# Altium schematic sheet LMR514205V.SchDoc
size A; SheetNumber: 7; SheetTotal: 8
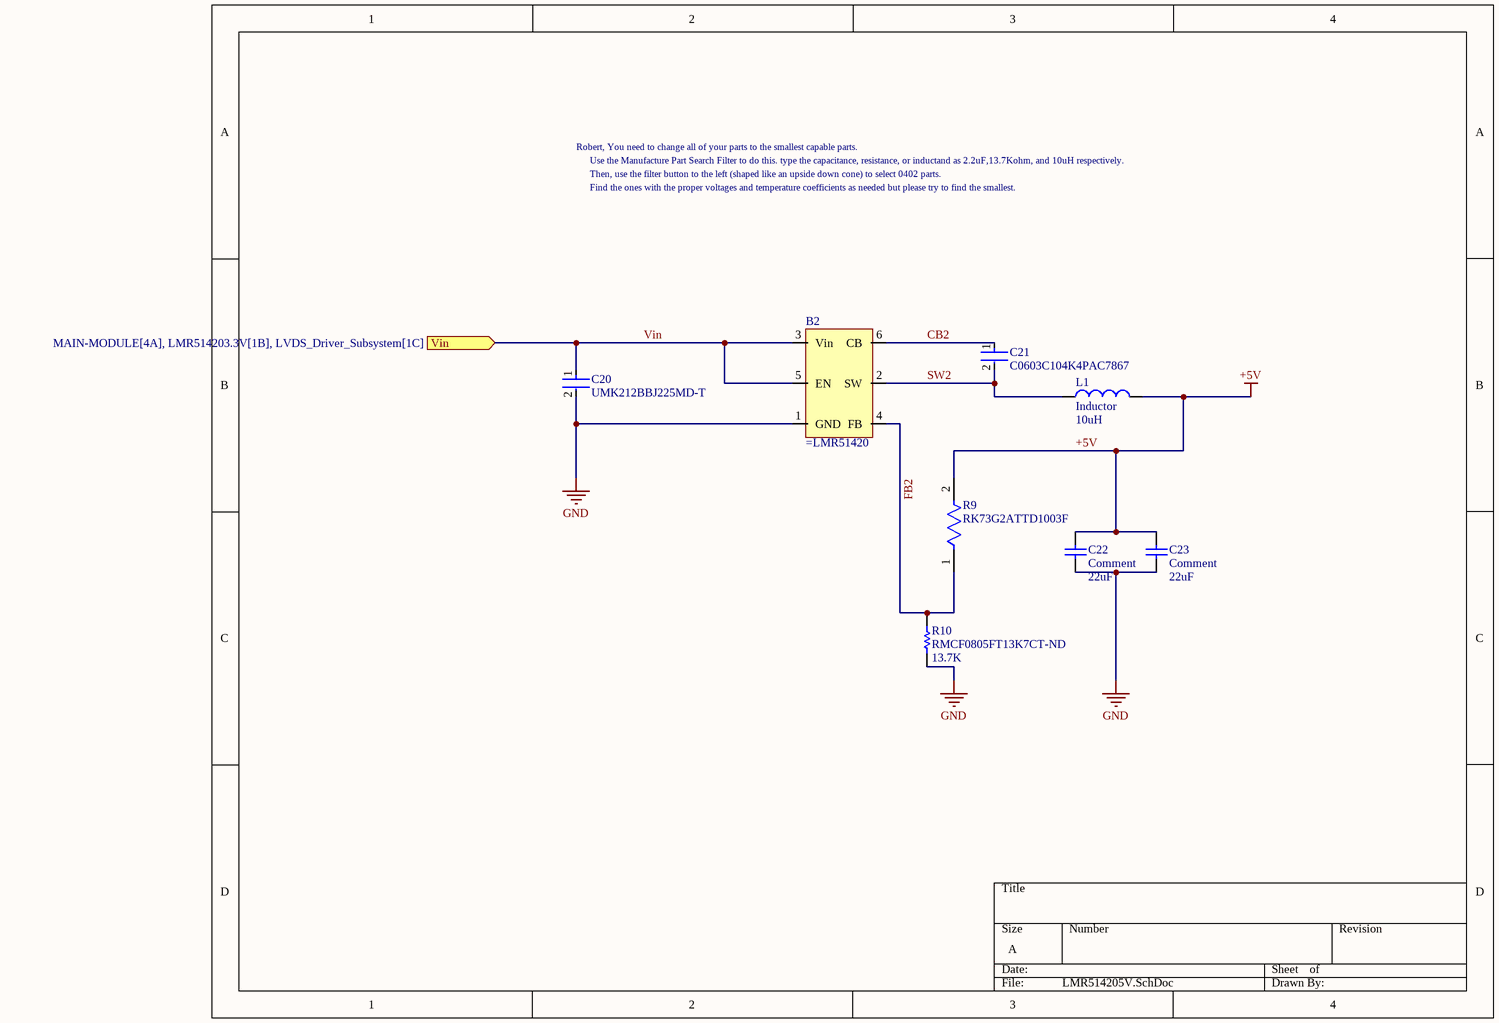
[diagram p0: LMR514205V.SchDoc]

## Parts
B2  (no value)  [LMR51420IC]
C20  UMK212BBJ225MD-T  [FP-0805-L_2_0_0_2-W_1_25-IPC_A]
C21  C0603C104K4PAC7867  [CAP CER 0.1UF 16V X7R 0603]
C22  Comment  value 22uF  [Cap22uF_C1206C226M4PAC7800]
C23  Comment  value 22uF  [Cap22uF_C1206C226M4PAC7800]
L1  Inductor  value 10uH  [MSS1246H-103MED 10uH]
R9  RK73G2ATTD1003F  [FP-RK73G2A-IPC_A]
R10  RMCF0805FT13K7CT-ND  value 13.7K  [RMCF0805FT13K7_13.7k]

## Ports
Vin (in, see MAIN-MODULE[4A], LMR514203.3V[1B], LVDS_Driver_Subsystem[1C])

## Nets
+5V: C22.2 C23.2 L1.2 R9.2
GND: B2.1(GND) C20.2 C22.1 C23.1 R10.1
CB2: B2.6(CB) C21.1
FB2: B2.4(FB) R9.1 R10.2
SW2: B2.2(SW) C21.2 L1.1
Vin: B2.3(Vin) B2.5(EN) C20.1 ; port Vin

## Notes on the sheet
- Robert, You need to change all of your parts to the smallest capable parts.
- Use the Manufacture Part Search Filter to do this. type the capacitance, resistance, or inductand as 2.2uF,13.7Kohm, and 10uH respectively.
- Then, use the filter button to the left (shaped like an upside down cone) to select 0402 parts.
- Find the ones with the proper voltages and temperature coefficients as needed but please try to find the smallest.

## Library data of the parts
B2 = Component_1
C20 = CMP-14477-004278-2: Multilayer Ceramic Capacitor 2.2uF 50V X5R 20% SMD 0803 T/R; Max Operating Temperature: 85°C; Tolerance: 20%; Case Code (Imperial): 0805; Case/Package: 0805; Case Code (Metric): 2012; Capacitance: 2.2uF; Min Operating Temperature: -55°C; Mount: Surface Mount; Voltage Rating: 50V; Packaging: Tape and Reel; RoHS Compliant: Yes
C21 = b4654b650e69147ec39a6b967a45e02: CAP CER 0.1UF 16V X5R 0603; Manufacturer: KEMET; Automotive Grade: Grade 1; Value: 0.10 μF; Material: Ceramic; Temperature Coefficient: 30ppm/°C; Tolerance: 0.1; Manufacturer Part Number: C0603C104K4PAC7867; Automotive: Yes; Octopart: https://octopart.com/c0603c104k4pactu-kemet-12592163; Device Class L2: Capacitors; ComponentLink2URL: https://api.kemet.com/component-edge/download/datasheet/C0603C100J5GACAUTO.pdf; RoHS: TRUE; Height: 0.87mm; Temperature Characteristic: X5R; Voltage Rating: 16 V; Device Class L1: Passive Components; Category: Cap; Digikey Description: CAP CER 0.1UF 16V X5R 0603; Temperature Range High: +125°C; Package: C0603C-CF; Device Class L3: Ceramic Capacitors; Lead Free: Yes; Temperature: -55°C to +125°C; Temperature Range Low: -55°C; Capacitance: 0.10 μF; ComponentLink2Description: Datasheet
C22 C23 = Cap: Capacitor; Published: 8-Jun-2000; LatestRevisionDate: 17-Jul-2002; LatestRevisionNote: Re-released for DXP Platform.; PackageReference: RAD-0.3; Publisher: Altium Limited; PackageDescription: Radial Cap, Thru-Hole; 2 Leads; 0.3 in Pin Spacing
L1 = Inductor: Code_IEC: 1005; Published: 8-Jun-2000; LatestRevisionDate: 29-May-2009; LatestRevisionNote: IPC-7351 Footprint Added.; PackageReference: 0402-A; Publisher: Altium Limited; PackageDescription: Chip Inductor; Code_JEITA: 0402
R9 = CMP-04015-080178-1: 100kΩ ±1% 0.125W Chip Resistor 0805 Thick Film AEC-Q200 Qualified; Voltage Rating: 150V; Power Rating: 125mW; Temperature Coefficient: 50ppm/°C; Resistance: 100kR; Series: RK73G; Termination: SMD/SMT; Packaging: Tape and Reel; Tolerance: 1%; Case Code (Imperial): 0805; RoHS Compliant: Yes; Max Operating Temperature: 125°C; Min Operating Temperature: -55°C; Case Code (Metric): 2012
R10 = Res1: Resistor; Published: 8-Jun-2000; LatestRevisionDate: 17-Jul-2002; LatestRevisionNote: Re-released for DXP Platform.; PackageReference: AXIAL-0.3; Publisher: Altium Limited; PackageDescription: Axial Device, Thru-Hole; 2 Leads; 0.3 in Pin Spacing